# EAGLE design ADC (EAGLE 6.5.0)
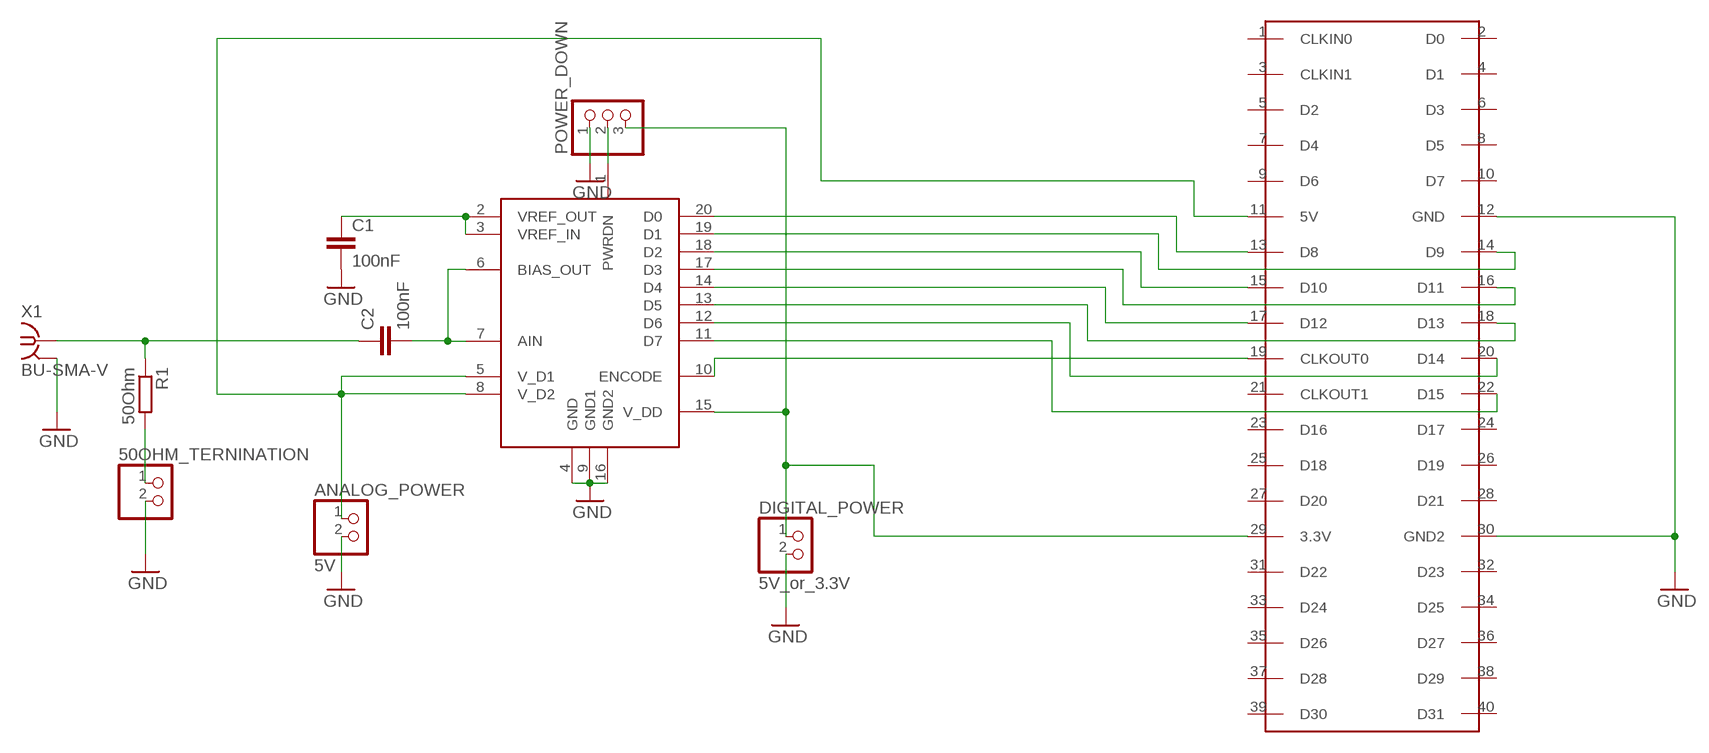
[diagram p0: schematic, sheet 1]

## Parts
50OHM_TERNINATION  PINHD-1X2  [1X02]
ANALOG_POWER  5V  PINHD-1X2  [1X02]
C1  100nF  C2.5/5  [C2.5-5]
C2  100nF  C2.5/5  [C2.5-5]
DIGITAL_POWER  5V_or_3.3V  PINHD-1X2  [1X02]
POWER_DOWN  PINHD-1X3  [1X03]
R1  50Ohm  R-EU_0207/10  [0207/10]
U$1  AD9057  [SSOP20]
U$2  FPGA_GPIO_DE0  [2X20]
X1  BU-SMA-V  [BU-SMA-V]

## Nets
GND: 50OHM_TERNINATION.2 ANALOG_POWER.2 C1.2 DIGITAL_POWER.2 POWER_DOWN.1 U$1.4(GND) U$1.9(GND1) U$1.16(GND2) U$2.12(GND) U$2.30(GND2) X1.2 X1.3 X1.4 X1.5
N$1: C2.2 U$1.6(BIAS_OUT) U$1.7(AIN)
N$2: C1.1 U$1.2(VREF_OUT) U$1.3(VREF_IN)
N$4: DIGITAL_POWER.1 POWER_DOWN.3 U$1.15(V_DD) U$2.29(3.3V)
N$5: C2.1 R1.1 X1.1
N$6: POWER_DOWN.2 U$1.1(PWRDN)
N$7: U$1.20(D0) U$2.13(D8)
N$8: U$1.19(D1) U$2.14(D9)
N$9: U$1.18(D2) U$2.15(D10)
N$10: U$1.17(D3) U$2.16(D11)
N$11: U$1.14(D4) U$2.17(D12)
N$12: U$1.13(D5) U$2.18(D13)
N$13: U$1.12(D6) U$2.20(D14)
N$14: U$1.11(D7) U$2.22(D15)
N$15: U$1.10(ENCODE) U$2.19(CLKOUT0)
N$17: ANALOG_POWER.1 U$1.5(V_D1) U$1.8(V_D2) U$2.11(5V)
N$21: 50OHM_TERNINATION.1 R1.2
Unconnected: U$2.1(CLKIN0) U$2.2(D0) U$2.3(CLKIN1) U$2.4(D1) U$2.5(D2) U$2.6(D3) U$2.7(D4) U$2.8(D5) U$2.9(D6) U$2.10(D7) U$2.21(CLKOUT1) U$2.23(D16) U$2.24(D17) U$2.25(D18) U$2.26(D19) U$2.27(D20) U$2.28(D21) U$2.31(D22) U$2.32(D23) U$2.33(D24) U$2.34(D25) U$2.35(D26) U$2.36(D27) U$2.37(D28) U$2.38(D29) U$2.39(D30) U$2.40(D31)

## Library data of the parts
50OHM_TERNINATION ANALOG_POWER DIGITAL_POWER = 0myLib:PINHD-1X2: PIN HEADER
C1 C2 = 0myLib:C: CAPACITOR naming: grid - package width
POWER_DOWN = 0myLib:PINHD-1X3: PIN HEADER
R1 = 0myLib:R-EU_: RESISTOR, European symbol
U$1 = 0myLib:AD9057: 8-Bit 40 MSPS/60 MSPS/80 MSPS A/D Converter
U$2 = 0myLib:FPGA_GPIO_DE0
X1 = 0myLib:BU-SMA-V: FEMALE SMA CONNECTOR Radiall distributor RS 112-3794; OC_FARNELL: unknown; OC_NEWARK: unknown

## Board
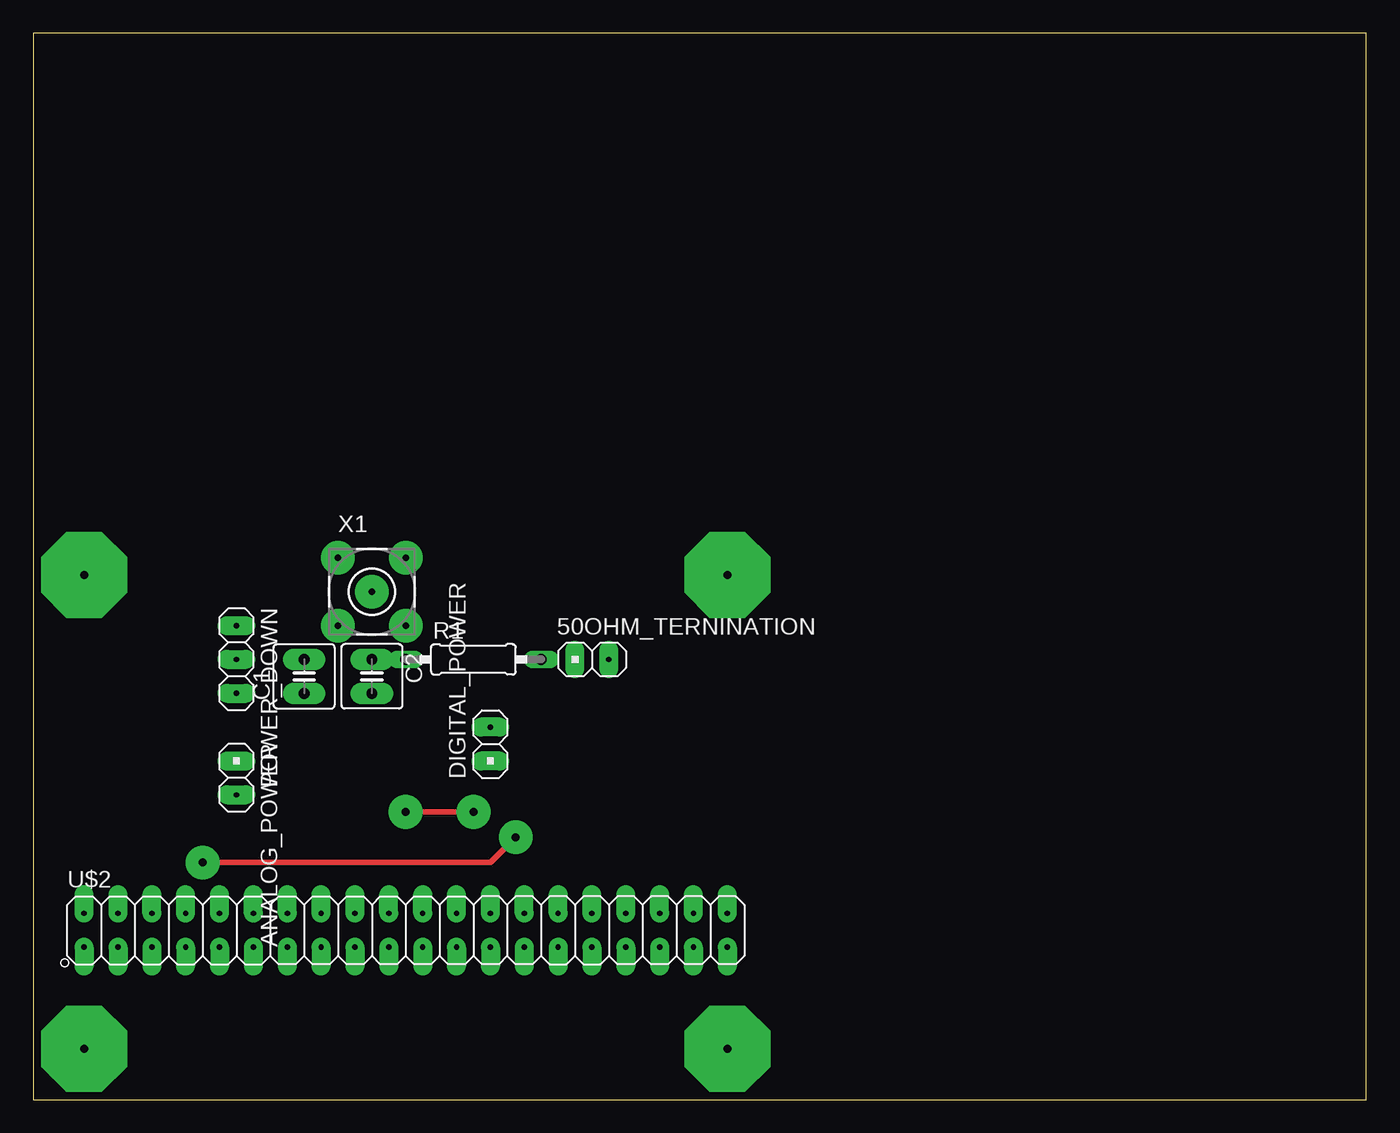
[diagram p1: board, top side]
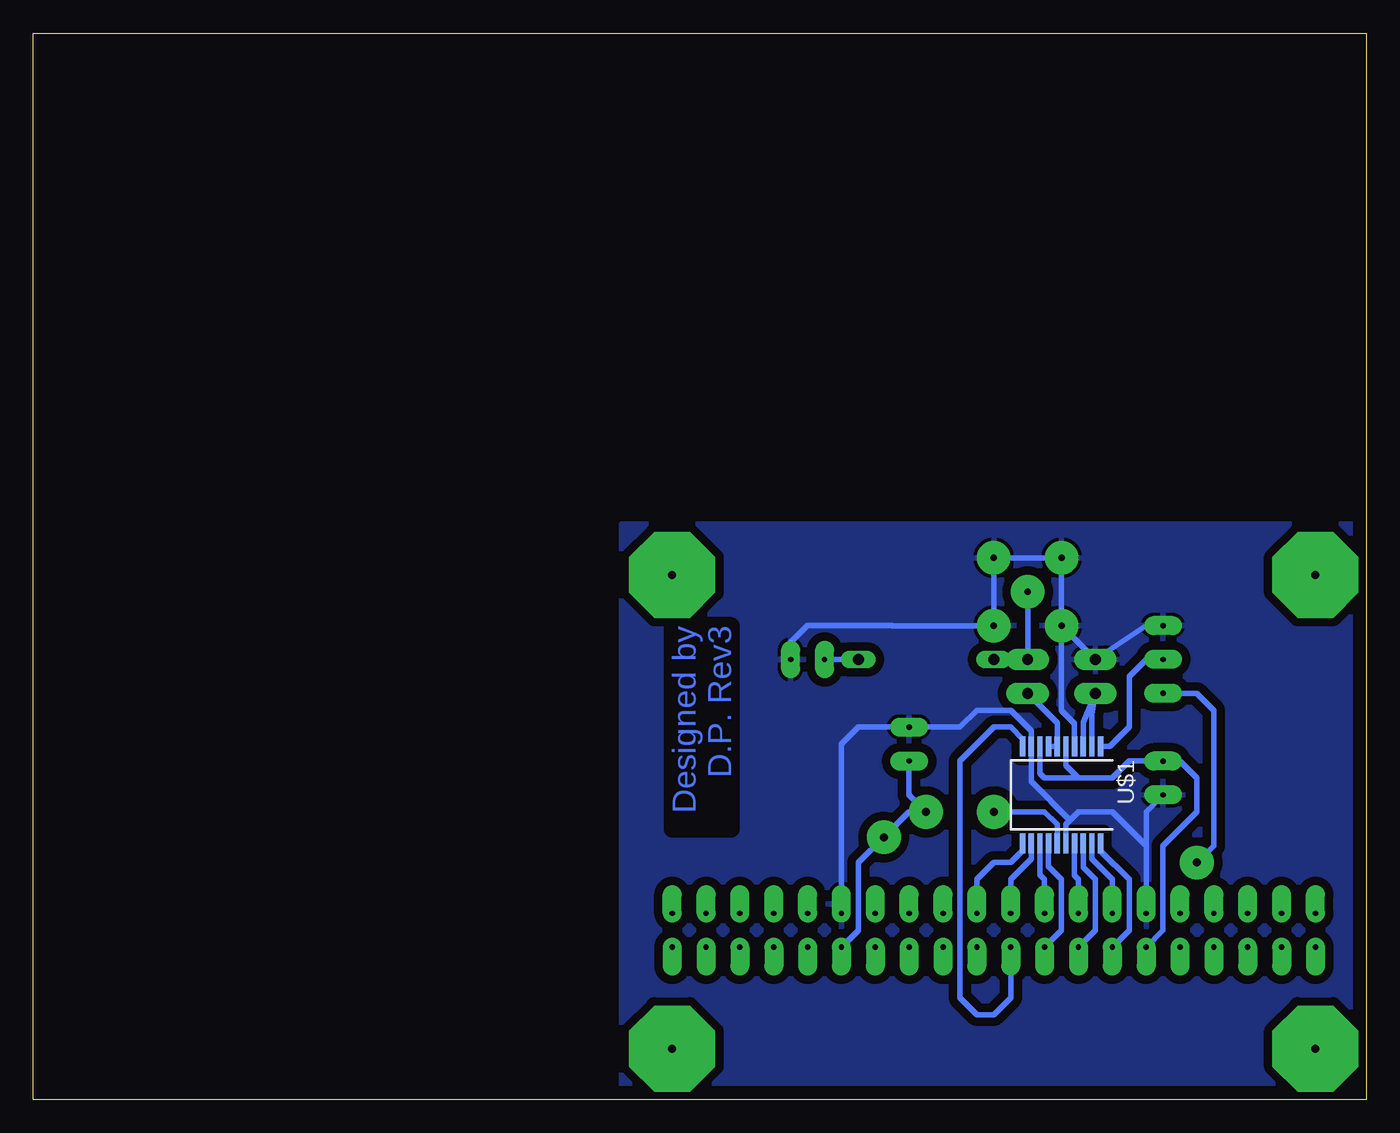
[diagram p2: board, bottom side, seen from below]

Size 100 x 80 mm. Coordinates in mm from the lower left corner, seen from the top.
Outline: 0,0 100,0 100,80 0,80 0,0
Copper layers (1*16): Top 0.035mm / dielectric 1.5mm / Bottom 0.035mm
Design rules "FinalizeAreaFill": minimum track width 12mil, minimum drill 1.4mm, track to track 25mil, track to pad 25mil, pad to pad 8mil, via to via 8mil, smd to smd 8mil, copper to edge 40mil, drill to drill 8mil, minimum pad ring 10mil, minimum via ring 8mil, stop-mask expansion 4mil, vias tented up to drill 0mil, thermal gap 10mil

### Footprints (pad centres in the part's own frame; a part is rotated, then mirrored left to right if it is on the bottom)
1X02 = drill 0.4 pad 1.422 long: 1 -1.27,0; 2 1.27,0
C2.5-5 = drill 0.813 pad 1.6 long: 1 -1.27,0; 2 1.27,0
1X03 = drill 0.4 pad 1.422 long: 1 -2.54,0; 2 0,0; 3 2.54,0
0207/10 = drill 0.813 long: 1 -5.08,0; 2 5.08,0
SSOP20 = smd 0.4 x 1.5: 1 -2.925,-3.625; 2 -2.275,-3.625; 3 -1.625,-3.625; 4 -0.975,-3.625; 5 -0.325,-3.625; 6 0.325,-3.625; 7 0.975,-3.625; 8 1.625,-3.625; 9 2.275,-3.625; 10 2.925,-3.625; 11 2.925,3.625; 12 2.275,3.625; 13 1.625,3.625; 14 0.975,3.625; 15 0.325,3.625; 16 -0.325,3.625; 17 -0.975,3.625; 18 -1.625,3.625; 19 -2.275,3.625; 20 -2.925,3.625
2X20 = drill 0.4 pad 1.422 offset: 1 -24.13,-1.27; 2 -24.13,1.27; 3 -21.59,-1.27; 4 -21.59,1.27; 5 -19.05,-1.27; 6 -19.05,1.27; 7 -16.51,-1.27; 8 -16.51,1.27; 9 -13.97,-1.27; 10 -13.97,1.27; 11 -11.43,-1.27; 12 -11.43,1.27; 13 -8.89,-1.27; 14 -8.89,1.27; 15 -6.35,-1.27; 16 -6.35,1.27; 17 -3.81,-1.27; 18 -3.81,1.27; 19 -1.27,-1.27; 20 -1.27,1.27; 21 1.27,-1.27; 22 1.27,1.27; 23 3.81,-1.27; 24 3.81,1.27; 25 6.35,-1.27; 26 6.35,1.27; 27 8.89,-1.27; 28 8.89,1.27; 29 11.43,-1.27; 30 11.43,1.27; 31 13.97,-1.27; 32 13.97,1.27; 33 16.51,-1.27; 34 16.51,1.27; 35 19.05,-1.27; 36 19.05,1.27; 37 21.59,-1.27; 38 21.59,1.27; 39 24.13,-1.27; 40 24.13,1.27
BU-SMA-V = drill 0.5 pad 2.54: 1 0,0; 2 -2.55,2.55; 3 2.55,2.55; 4 2.55,-2.55; 5 -2.55,-2.55

### Placement (x,y rotation side)
50OHM_TERNINATION  41.91,33.02 0 top
ANALOG_POWER  15.24,24.13 270 top
C1  20.32,31.75 90 top
C2  25.4,31.75 270 top
DIGITAL_POWER  34.29,26.67 90 top
POWER_DOWN  15.24,33.02 270 top
R1  33.02,33.02 0 top
U$1  22.86,22.86 180 bottom
U$2  27.94,12.7 0 top
X1  25.4,38.1 0 top

### Tracks (layer width: path | path; a pad name or v marks a point on that pad's centre or on a via)
GND
  Bottom 0.406: X1.5 X1.2 X1.3 X1.4 35.58,35.54 35.6,35.56 41.91,35.56 43.18,34.29 50OHM_TERNINATION.2 | U$2.12 16.51,19.05 | 16.51,19.05 19.05,21.59 21.59,21.59 22.23,20.95 | U$1.16 22.54,20.64 22.23,20.95 | POWER_DOWN.1 16.51,35.56 C1.2 X1.5 | U$1.4 21.89,28.23 22.86,29.21 X1.5 | U$2.30 39.37,26.67 38.1,27.94 DIGITAL_POWER.2 30.48,27.94 29.21,29.21 26.67,29.21 25.14,27.68 U$1.9 25.14,23.86 22.23,20.95 | 16.51,19.05 16.51,21.59 ANALOG_POWER.2
  pour Bottom: 0,43.18 55.88,43.18 55.88,0 0,0
N$1
  Bottom 0.406: C2.2 23.18,28.27 U$1.6 U$1.7
N$2
  Bottom 0.406: U$1.3 21.23,28.3 C1.1 20.59,28.95 U$1.2
N$3  (via drill 0.6 pad 6.45)
  other vias: 3.81,3.81
N$4  (via drill 0.6 pad 2.54)
  Top 0.406: v27.94,21.59 v33.02,21.59 | v12.7,17.78 34.29,17.78 v36.2,19.68
  Bottom 0.406: U$1.15 23.18,20.64 24.13,21.59 v27.94,21.59 | POWER_DOWN.3 12.7,30.48 11.43,29.21 11.43,19.05 v12.7,17.78 | DIGITAL_POWER.1 34.29,22.86 v33.02,21.59 34.29,21.59 v36.2,19.68 38.1,17.78 38.1,12.7 U$2.29
N$5
  Bottom 0.406: X1.1 C2.1 R1.1
N$6
  Bottom 0.406: U$1.1 19.23,26.48 17.78,27.94 17.78,31.75 16.51,33.02 POWER_DOWN.2
N$7
  Bottom 0.406: U$1.20 19.93,18.66 17.78,16.51 17.78,12.7 U$2.13
N$8
  Bottom 0.406: U$1.19 20.59,18.05 19.05,16.51 U$2.14
N$9
  Bottom 0.406: U$1.18 21.23,17.43 20.32,16.51 20.32,12.7 U$2.15
N$10
  Bottom 0.406: U$1.17 21.89,16.8 21.59,16.51 U$2.16
N$11
  Bottom 0.406: U$1.14 23.84,17.48 22.86,16.51 22.86,12.7 U$2.17
N$12
  Bottom 0.406: U$1.13 24.48,16.86 24.13,16.51 U$2.18
N$13
  Bottom 0.406: U$2.20 26.67,16.51 25.14,18.05 U$1.12
N$14
  Bottom 0.406: U$1.11 25.79,18.66 26.67,17.78 27.94,17.78 29.21,16.51 U$2.22
N$15
  Bottom 0.406: U$1.10 25.79,27.05 26.67,27.94 27.94,27.94 30.48,25.4 30.48,7.62 29.21,6.35 27.94,6.35 26.67,7.62 U$2.19
N$16  (via drill 0.6 pad 6.45)
  other vias: 52.07,3.81
N$17
  Bottom 0.406: U$2.11 15.24,12.7 15.24,19.05 12.7,21.59 12.7,24.13 13.97,25.4 ANALOG_POWER.1 17.78,25.4 19.05,24.13 21.59,24.13 | U$1.5 22.54,25.07 21.59,24.13 | U$1.8 24.48,24.48 24.13,24.13 21.59,24.13
N$18  (via drill 0.6 pad 6.45)
  other vias: 3.81,39.37
N$19  (via drill 0.6 pad 6.45)
  other vias: 52.07,39.37
N$20
  pour Bottom: 0,43.18 55.88,43.18 55.88,0 0,0
N$21
  Bottom 0.406: R1.2 50OHM_TERNINATION.1

### Text on the board
Bottom: Designed by / D.P. Rev3